# Altium schematic sheet sha2017_rev1_0_0_0.SchDoc: sha2017_rev1_0_0
size 409 x 282 mm; Date: 4/24/2017 5:58:56 PM; SheetNumber: 1
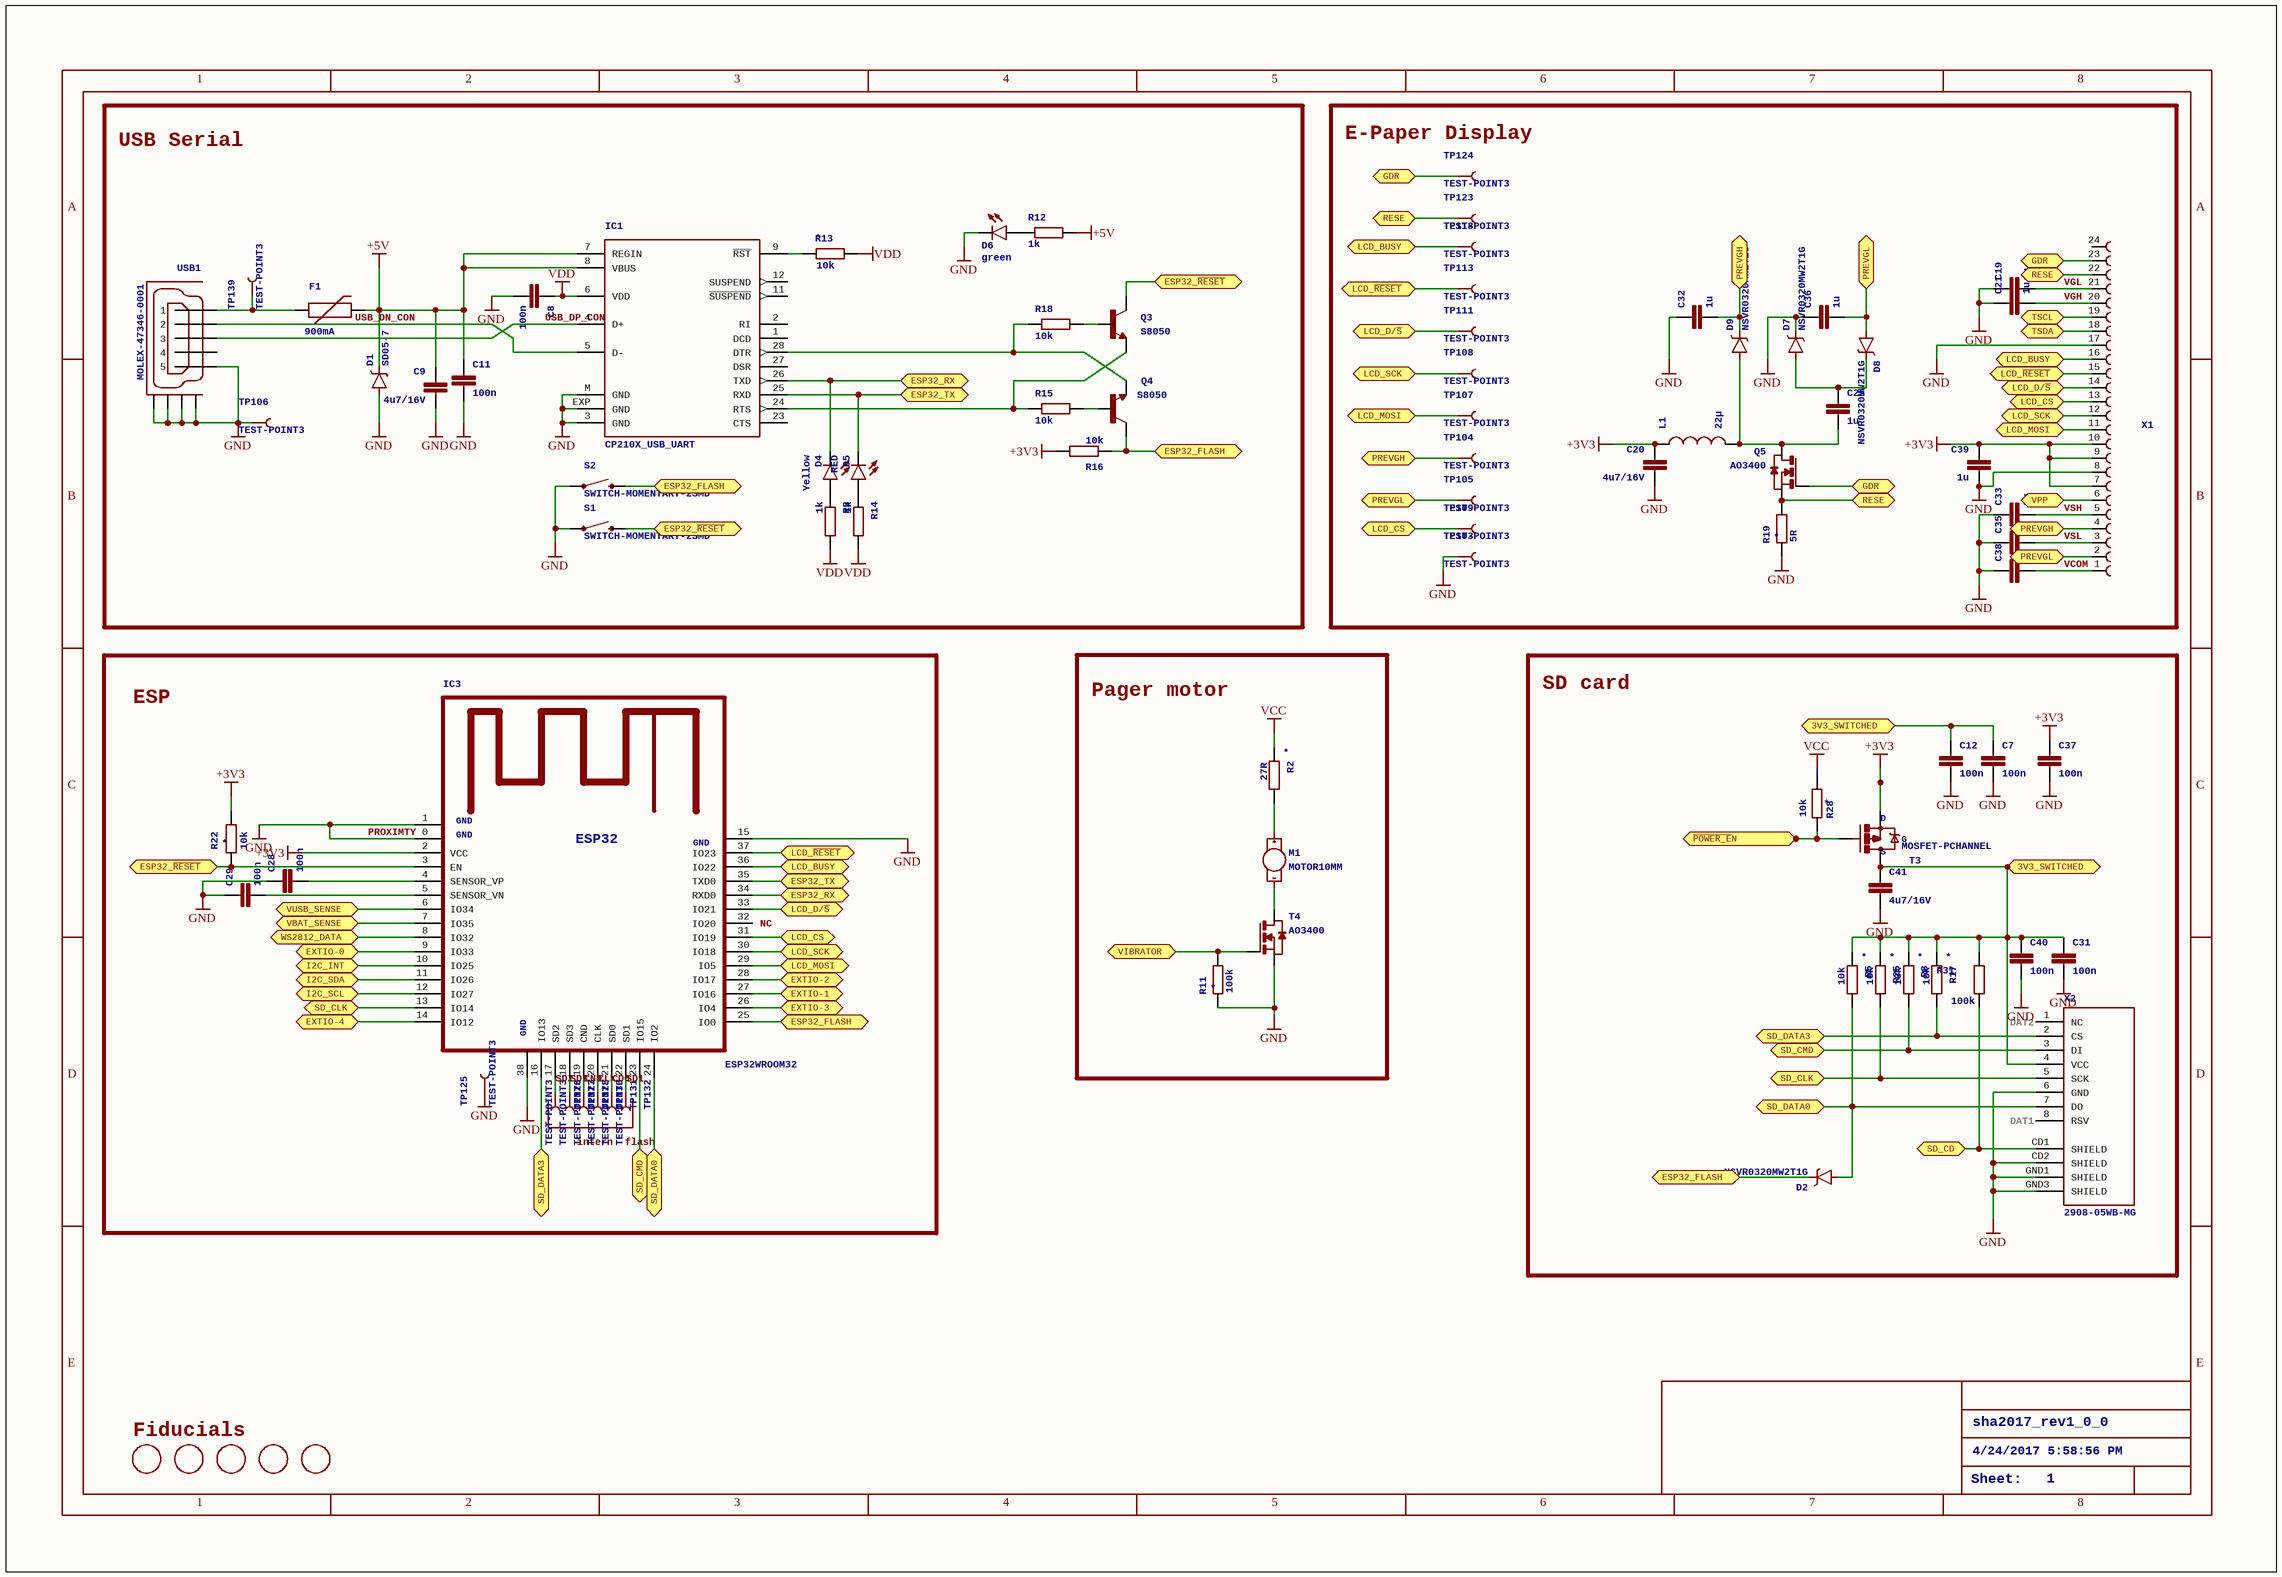
[diagram p0: sha2017_rev1_0_0_0.SchDoc]

## Parts
C7  100n  [C0603-DASHES]
C8  100n  [C0603-DASHES]
C9  4u7/16V  [C0805]
C11  100n  [C0603-DASHES]
C12  100n  [C0603-DASHES]
C19  1u  [C0603-DASHES]
C20  4u7/16V  [C0805]
C21  1u  [C0603-DASHES]
C25  1u  [C0603-DASHES]
C28  100n  [C0603-DASHES]
C29  100n  [C0603-DASHES]
C31  100n  [C0603-DASHES]
C32  1u  [C0603-DASHES]
C33  1u  [C0603-DASHES]
C35  1u  [C0603-DASHES]
C36  1u  [C0603-DASHES]
C37  100n  [C0603-DASHES]
C38  1u  [C0603-DASHES]
C39  1u  [C0603-DASHES]
C40  100n  [C0603-DASHES]
C41  4u7/16V  [C0805]
D1  SD05-7  [SOD-323]
D2  NSVR0320MW2T1G  [SOD-323]
D4  Yellow  [LED-0603]
D5  RED  [LED-0603]
D6  green  [LED-0603]
D7  NSVR0320MW2T1G  [SOD-323]
D8  NSVR0320MW2T1G  [SOD-323]
D9  NSVR0320MW2T1G  [SOD-323]
F1  900mA  [PTC-1206]
FD1  FIDUCIAL  [FIDUCIAL_1MM]  (value not drawn)
FD2  FIDUCIAL  [FIDUCIAL_1MM]  (value not drawn)
FD3  FIDUCIAL  [FIDUCIAL_1MM]  (value not drawn)
FD4  FIDUCIAL  [FIDUCIAL_1MM]  (value not drawn)
FD5  FIDUCIAL  [FIDUCIAL_1MM]  (value not drawn)
IC1  CP210X_USB_UART  [MLP28]
IC3  ESP32WROOM32  [ESP32MOD]
L1  22µ  [1210]
M1  MOTOR10MM  [VIBE-MOTOR-10MM]
Q3  S8050  [SOT23-3]
Q4  S8050  [SOT23-3]
Q5  AO3400  [SOT-23]
R2  27R  [R0603-DASHES]
R3  1k  [R0603-DASHES]
R5  10k  [R0603-DASHES]
R8  10k  [R0603-DASHES]
R11  100k  [R0603-DASHES]
R12  1k  [R0603-DASHES]
R13  10k  [R0603-DASHES]
R14  1k  [R0603-DASHES]
R15  10k  [R0603-DASHES]
R16  10k  [R0603-DASHES]
R17  10k  [R0603-DASHES]
R18  10k  [R0603-DASHES]
R19  5R  [R0603-DASHES]
R22  10k  [R0603-DASHES]
R25  10k  [R0603-DASHES]
R28  10k  [R0603-DASHES]
R31  100k  [R0603-DASHES]
S1  SWITCH-MOMENTARY-2SMD  [TACTILE-SWITCH-SMD]
S2  SWITCH-MOMENTARY-2SMD  [TACTILE-SWITCH-SMD]
T3  MOSFET-PCHANNEL  [SOT23-3]
T4  AO3400  [SOT-23]
TP103  TEST-POINT3  [PAD.03X.03]
TP104  TEST-POINT3  [PAD.03X.03]
TP105  TEST-POINT3  [PAD.03X.03]
TP106  TEST-POINT3  [PAD.03X.03]
TP107  TEST-POINT3  [PAD.03X.03]
TP108  TEST-POINT3  [PAD.03X.03]
TP109  TEST-POINT3  [PAD.03X.03]
TP111  TEST-POINT3  [PAD.03X.03]
TP113  TEST-POINT3  [PAD.03X.03]
TP118  TEST-POINT3  [PAD.03X.03]
TP123  TEST-POINT3  [PAD.03X.03]
TP124  TEST-POINT3  [PAD.03X.03]
TP125  TEST-POINT3  [PAD.03X.03]
TP126  TEST-POINT3  [PAD.03X.03]
TP127  TEST-POINT3  [PAD.03X.03]
TP128  TEST-POINT3  [PAD.03X.03]
TP130  TEST-POINT3  [PAD.03X.03]
TP131  TEST-POINT3  [PAD.03X.03]
TP132  TEST-POINT3  [PAD.03X.03]
TP139  TEST-POINT3  [PAD.03X.03]
USB1  MOLEX-47346-0001  [MOLEX-47364-0001]
X1  68712414022  [68712414022]  (value not drawn)
X2  2908-05WB-MG  [MICRO-SD-SOCKET-PP]

## Blocks framed on the sheet
USB Serial: C8 C9 C11 D1 D4-D6 F1 IC1 Q3 Q4 R3 R12-R16 R18 S1 S2 TP106 TP139 USB1
E-Paper Display: C19-C21 C25 C32 C33 C35 C36 C38 C39 D7-D9 L1 Q5 R19 TP103-TP105 TP107-TP109 TP111 TP113 TP118 TP123 TP124 X1
ESP: C28 C29 IC3 R22 TP125-TP128 TP130-TP132
Pager motor: M1 R2 R11 T4
SD card: C7 C12 C31 C37 C40 C41 D2 R5 R8 R17 R25 R28 R31 T3 X2

## Ports
3V3_SWITCHED, ESP32_FLASH, ESP32_RX, ESP32_TX, ESP32_~{RESET}, EXTIO-0, EXTIO-1, EXTIO-2, EXTIO-3, EXTIO-4, GDR, I2C_INT, I2C_SCL, I2C_SDA, LCD_BUSY, LCD_CS, LCD_D/~{S}, LCD_MOSI, LCD_SCK, LCD_~{RESET}, PREVGH, PREVGL, RESE, SD_CD, SD_CLK, SD_CMD, SD_DATA0, SD_DATA3, TSCL, TSDA, VBAT_SENSE, VIBRATOR, VPP, VUSB_SENSE, WS2812_DATA, ~{POWER_E}N

## Nets
+3V3: C20.1 C37.1 C39.1 IC3.2(VCC) L1.1 R16.2 R22.1 T3.2(S) X1.7 X1.9 X1.10
+5V: C9.1 C11.1 D1.C F1.2 IC1.7(REGIN) IC1.8(VBUS) R12.2
PROXIMTY: C7.2 C8.2 C9.2 C11.2 C12.2 C19.1 C20.2 C21.1 C28.1 C29.1 C31.2 C32.1 C33.1 C35.1 C36.1 C37.2 C38.1 C39.2 C40.2 C41.2 D1.A D6.C D7.C IC1.3(GND) IC1.EXP(GND) IC1.M(GND) IC3.0(GND) IC3.1(GND) IC3.15(GND) IC3.38(GND) R11.2 R19.2 S1.1 S2.1 T4.2(S) TP103.P$1 TP106.P$1 TP125.P$1 USB1.5 USB1.GND1 USB1.GND2 USB1.GND3 USB1.GND4 X1.8 X1.17 X2.6(GND) X2.CD2(SHIELD) X2.GND1(SHIELD) X2.GND3(SHIELD)  [also labelled GND]
VCC: R2.2 R28.2
VDD: C8.1 IC1.6(VDD) R3.2 R13.1 R14.2
3V3_SWITCHED: C7.1 C12.1 C31.1 C40.1 C41.1 R5.2 R8.2 R17.2 R25.2 R31.1 T3.3(D) X2.4(VCC) ; port 3V3_SWITCHED
~{POWER_E}N: R28.1 T3.1(G) ; port ~{POWER_E}N
CD0: IC3.21(SD0) TP131.P$1
CLK: IC3.20(CLK) TP130.P$1
CND: IC3.19(CND) TP128.P$1
ESP32_FLASH: D2.C IC3.25(IO0) Q4.3(C) R16.1 S2.3 ; port ESP32_FLASH
ESP32_~{RESET}: IC3.3(EN) Q3.3(C) R22.2 S1.3 ; port ESP32_~{RESET}
ESP32_RX: D4.C IC1.26(TXD) IC3.34(RXD0) ; port ESP32_RX
ESP32_TX: D5.C IC1.25(RXD) IC3.35(TXD0) ; port ESP32_TX
EXTIO-0: IC3.9(IO33) ; port EXTIO-0
EXTIO-1: IC3.27(IO16) ; port EXTIO-1
EXTIO-2: IC3.28(IO17) ; port EXTIO-2
EXTIO-3: IC3.26(IO4) ; port EXTIO-3
EXTIO-4: IC3.14(IO12) ; port EXTIO-4
GDR: Q5.3(G) TP124.P$1 X1.23 ; port GDR
I2C_INT: IC3.10(IO25) ; port I2C_INT
I2C_SCL: IC3.12(IO27) ; port I2C_SCL
I2C_SDA: IC3.11(IO26) ; port I2C_SDA
LCD_BUSY: IC3.36(IO22) TP118.P$1 X1.16 ; port LCD_BUSY
LCD_CS: IC3.31(IO19) TP109.P$1 X1.13 ; port LCD_CS
LCD_D/~{S}: IC3.33(IO21) TP111.P$1 X1.14 ; port LCD_D/~{S}
LCD_MOSI: IC3.29(IO5) TP107.P$1 X1.11 ; port LCD_MOSI
LCD_~{RESET}: IC3.37(IO23) TP113.P$1 X1.15 ; port LCD_~{RESET}
LCD_SCK: IC3.30(IO18) TP108.P$1 X1.12 ; port LCD_SCK
PREVGH: C32.2 D9.C TP104.P$1 X1.4 ; port PREVGH
PREVGL: C36.2 D8.A TP105.P$1 X1.2 ; port PREVGL
RESE: Q5.2(S) R19.1 TP123.P$1 X1.22 ; port RESE
SD1: IC3.22(SD1) TP132.P$1
SD2: IC3.17(SD2) TP126.P$1
SD3: IC3.18(SD3) TP127.P$1
SD_CD: R31.2 X2.CD1(SHIELD) ; port SD_CD
SD_CLK: IC3.13(IO14) R25.1 X2.5(SCK) ; port SD_CLK
SD_CMD: IC3.23(IO15) R8.1 X2.3(DI) ; port SD_CMD
SD_DATA0: D2.A IC3.24(IO2) R5.1 X2.7(DO) ; port SD_DATA0
SD_DATA3: IC3.16(IO13) R17.1 X2.2(CS) ; port SD_DATA3
TSCL: X1.19 ; port TSCL
TSDA: X1.18 ; port TSDA
USB_DN_CON: IC1.5(D-) USB1.2
USB_DP_CON: IC1.4(D+) USB1.3
VBAT_SENSE: IC3.7(IO35) ; port VBAT_SENSE
VCOM: C38.2 X1.1
VGH: C21.2 X1.20
VGL: C19.2 X1.21
VIBRATOR: R11.1 T4.3(G) ; port VIBRATOR
VPP: X1.6 ; port VPP
VSH: C33.2 X1.5
VSL: C35.2 X1.3
VUSB_SENSE: IC3.6(IO34) ; port VUSB_SENSE
WS2812_DATA: IC3.8(IO32) ; port WS2812_DATA
NetC25_1: C25.1 D7.A D8.C
NetC25_2: C25.2 D9.A L1.2 Q5.1(D)
NetC28_2: C28.2 IC3.4(SENSOR_VP)
NetC29_2: C29.2 IC3.5(SENSOR_VN)
NetD4_A: D4.A R3.1
NetD5_A: D5.A R14.1
NetD6_A: D6.A R12.1
NetF1_1: F1.1 TP139.P$1 USB1.1
NetIC1_9: IC1.9(~{RST}) R13.2
NetIC1_24: IC1.24(RTS) Q3.2(E) R15.1
NetIC1_28: IC1.28(DTR) Q4.2(E) R18.1
NetM1_+: M1.+ R2.1
NetM1_-: M1.- T4.1(D)
NetQ3_1: Q3.1(B) R18.2
NetQ4_1: Q4.1(B) R15.2

Not connected (* = marked no-connect by the designer): IC1 1(DCD) 2(RI) 11(~{SUSPEND}) 12(SUSPEND) 23(CTS) 27(DSR); IC3 32(IO20); USB1 4; X1 24; X2 1(NC) 8(RSV)

## Notes on the sheet
- (near IC3) NC
- DAT2
- intern
  flash
- (near X2) DAT1
- Fiducials
- sha2017_rev1_0_0
- 4/24/2017 5:58:56 PM
- Sheet:
- 1
- 2
- 3
- 4
- 5
- 6
- 7
- 8
- A
- B
- C
- D
- E

## Library data of the parts
C7 C8 C11 C12 C19 C21 C25 C28 C29 C31-C33 C35-C40 = C0603-DASHES: PARTNO: *
  C28 C29: MF: *; MPN: *; OC_FARNELL: *
C9 C20 C41 = C-EUC0805: CAPACITOR, European symbol; PARTNO: *
D1 = DIODE-SCHOTTKY-PMEG4005EJ: Schottky diodes in SFE's production catalog   BAT20J 1A 23V 0.62Vf RB751 120mA 40V 0.37Vf PMEG4005EJ 0.5A 40V 0.42Vf MBRA140 1A 40V 0.5Vf B340A  3A 40V SMA; PROD_ID: DIO-10955; PARTNO: *
D2 D7-D9 = BAT20JFILM: 23V, 1A Schottky diode, SOD-323 package; PROD_ID: DIO-11623; PARTNO: *
D4-D6 = LED0603: LEDsStandard schematic elements and footprints for 5mm, 3mm, 1206, and 0603 sized LEDs. 5mm - Spark Fun Electronics SKU : COM-00529 (and others)
F1 = PTCSMD: Resettable Fuse PTCResettable Fuse. Spark Fun Electronics SKU : COM-08357; PROD_ID: RES-11150; PARTNO: *
FD1-FD5 = FIDUCIAL: For use by pick and place machines to calibrate the vision/machine, 1mm    By microbuilder.eu; MF: *; MPN: *; OC_FARNELL: *; PARTNO: *
IC1 = CP210X_USB_UART: Single-Chip USB to UART Bridge   Source: www.silabs.com .. CP2101.pdf / cp2102.pdf. Spark Fun Electronics SKU : COM-00310; PARTNO: *
L1 = INDUCTOR1210: Inductors   Basic Inductor/Choke - 0603 and 1206. Footprints are not proven and vary greatly between part numbers. SRN6045- 33uH, 20% 1.4A SDR0403-560KL - 56uH, 10%, 500mA RMS/740mA peak; PARTNO: *
M1 = MOTOR10MM: Vibration Motor- ROB-08449Physical dimension and wire connections for this powerful vibration motor. Motor has a self adhesive backing.
Q3 Q4 = TRANSISTOR_NPNMMBT2222A: Generic NPN BJT   MMBT2222A - TRANS-08049 (SOT-23, 1A 40V) MPSA42 - TRANS-09116 (SOT-23, 500mA 300V) MMBT5088LT1G - TRANS-11160 (SOT-23, 50 mA 30V)          BC547 -     COM-08928    (TO-92 45V 100mA) (1.Collector 2.Base 3.Emitter)             2N3904 -     COM-00521    (TO-92 40V 200mA) (1.Emitter 2.Base 3.Collector)             P2N2222A -     COM-12852    (TO-92 40V 600mA) (1.Collector 2.Base 3.Emitter); PARTNO: *; PROD_ID: TRANS-08049
Q5 T4 = NMOSSOT23: MOS FET; MF: *; MPN: *; OC_FARNELL: unknown; OC_NEWARK: unknown
R2 R3 R5 R8 R11-R19 R22 R25 R28 R31 = R0603-DASHES: PARTNO: *
  R2 R5 R8 R11 R13 R17 R19 R25 R28 R31: NAME: *
  R22: MF: *; MPN: *; NAME: *; OC_FARNELL: *
S1 S2 = SWITCH-MOMENTARY-2SMD: Various NO switches- pushbuttons, reed, etc; PROD_ID: SWCH-08247; PARTNO: *
T3 = MOSFET-PCHANNEL: Generic PMOSFET    IRLML2244 - TRANS-11153 (SOT-23 -20V -4.3A) (1.Gate 2.Source 3.Drain)     FQP27P06 - COM-10349(TO-220 -60V -27A) (1.Gate 2.Source 3.Drain); PROD_ID: TRANS-08285; PARTNO: *; D: D; S: S; G: G
TP103-TP109 TP111 TP113 TP118 TP123-TP128 TP130-TP132 TP139 = TEST-POINT3: Bare copper test points for troubleshooting or ICT; PARTNO: *
USB1 = MOLEX-47346-0001: MICRO USB B, BOTTOM MOUNT; PARTNO: *
X1 = 68712414022: WR-FPC 0.5mm SMT ZIF Horizontal Top Contact, 24 Pins=>Code : Con_FPC_ZIF_0.50_68712414022     Details see: http://katalog.we-online.de/en/em/687_1xx_140_22   Created 2014-07-09, Karrer Zheng 2014 (C) WÃ¼rth Elektronik; PARTNO: *
X2 = 2908-05WB-MG: 3M Card Connector microSD   Normal Polarisation, Push-Push, Surface-Mount, 2900 Series    2908-05WB-MG: Surface mount, right angle Supplier: DigiKey 3M5607CT-ND       Source: http://solutions.3m.com/wps/portal/3M/en_US/FP/FireProtection/Products/ProductCatalog/?PC_7_RJH9U5230GE3E02LECFTDQ0R92_nid=GGFDLLB87CbeGKZPW31NMHgl; PARTNO: *
IC3 = ESP32WROOM32: ESP32: ESP32; GND: GND